# EAGLE schematic miavita (EAGLE 6.5.0)
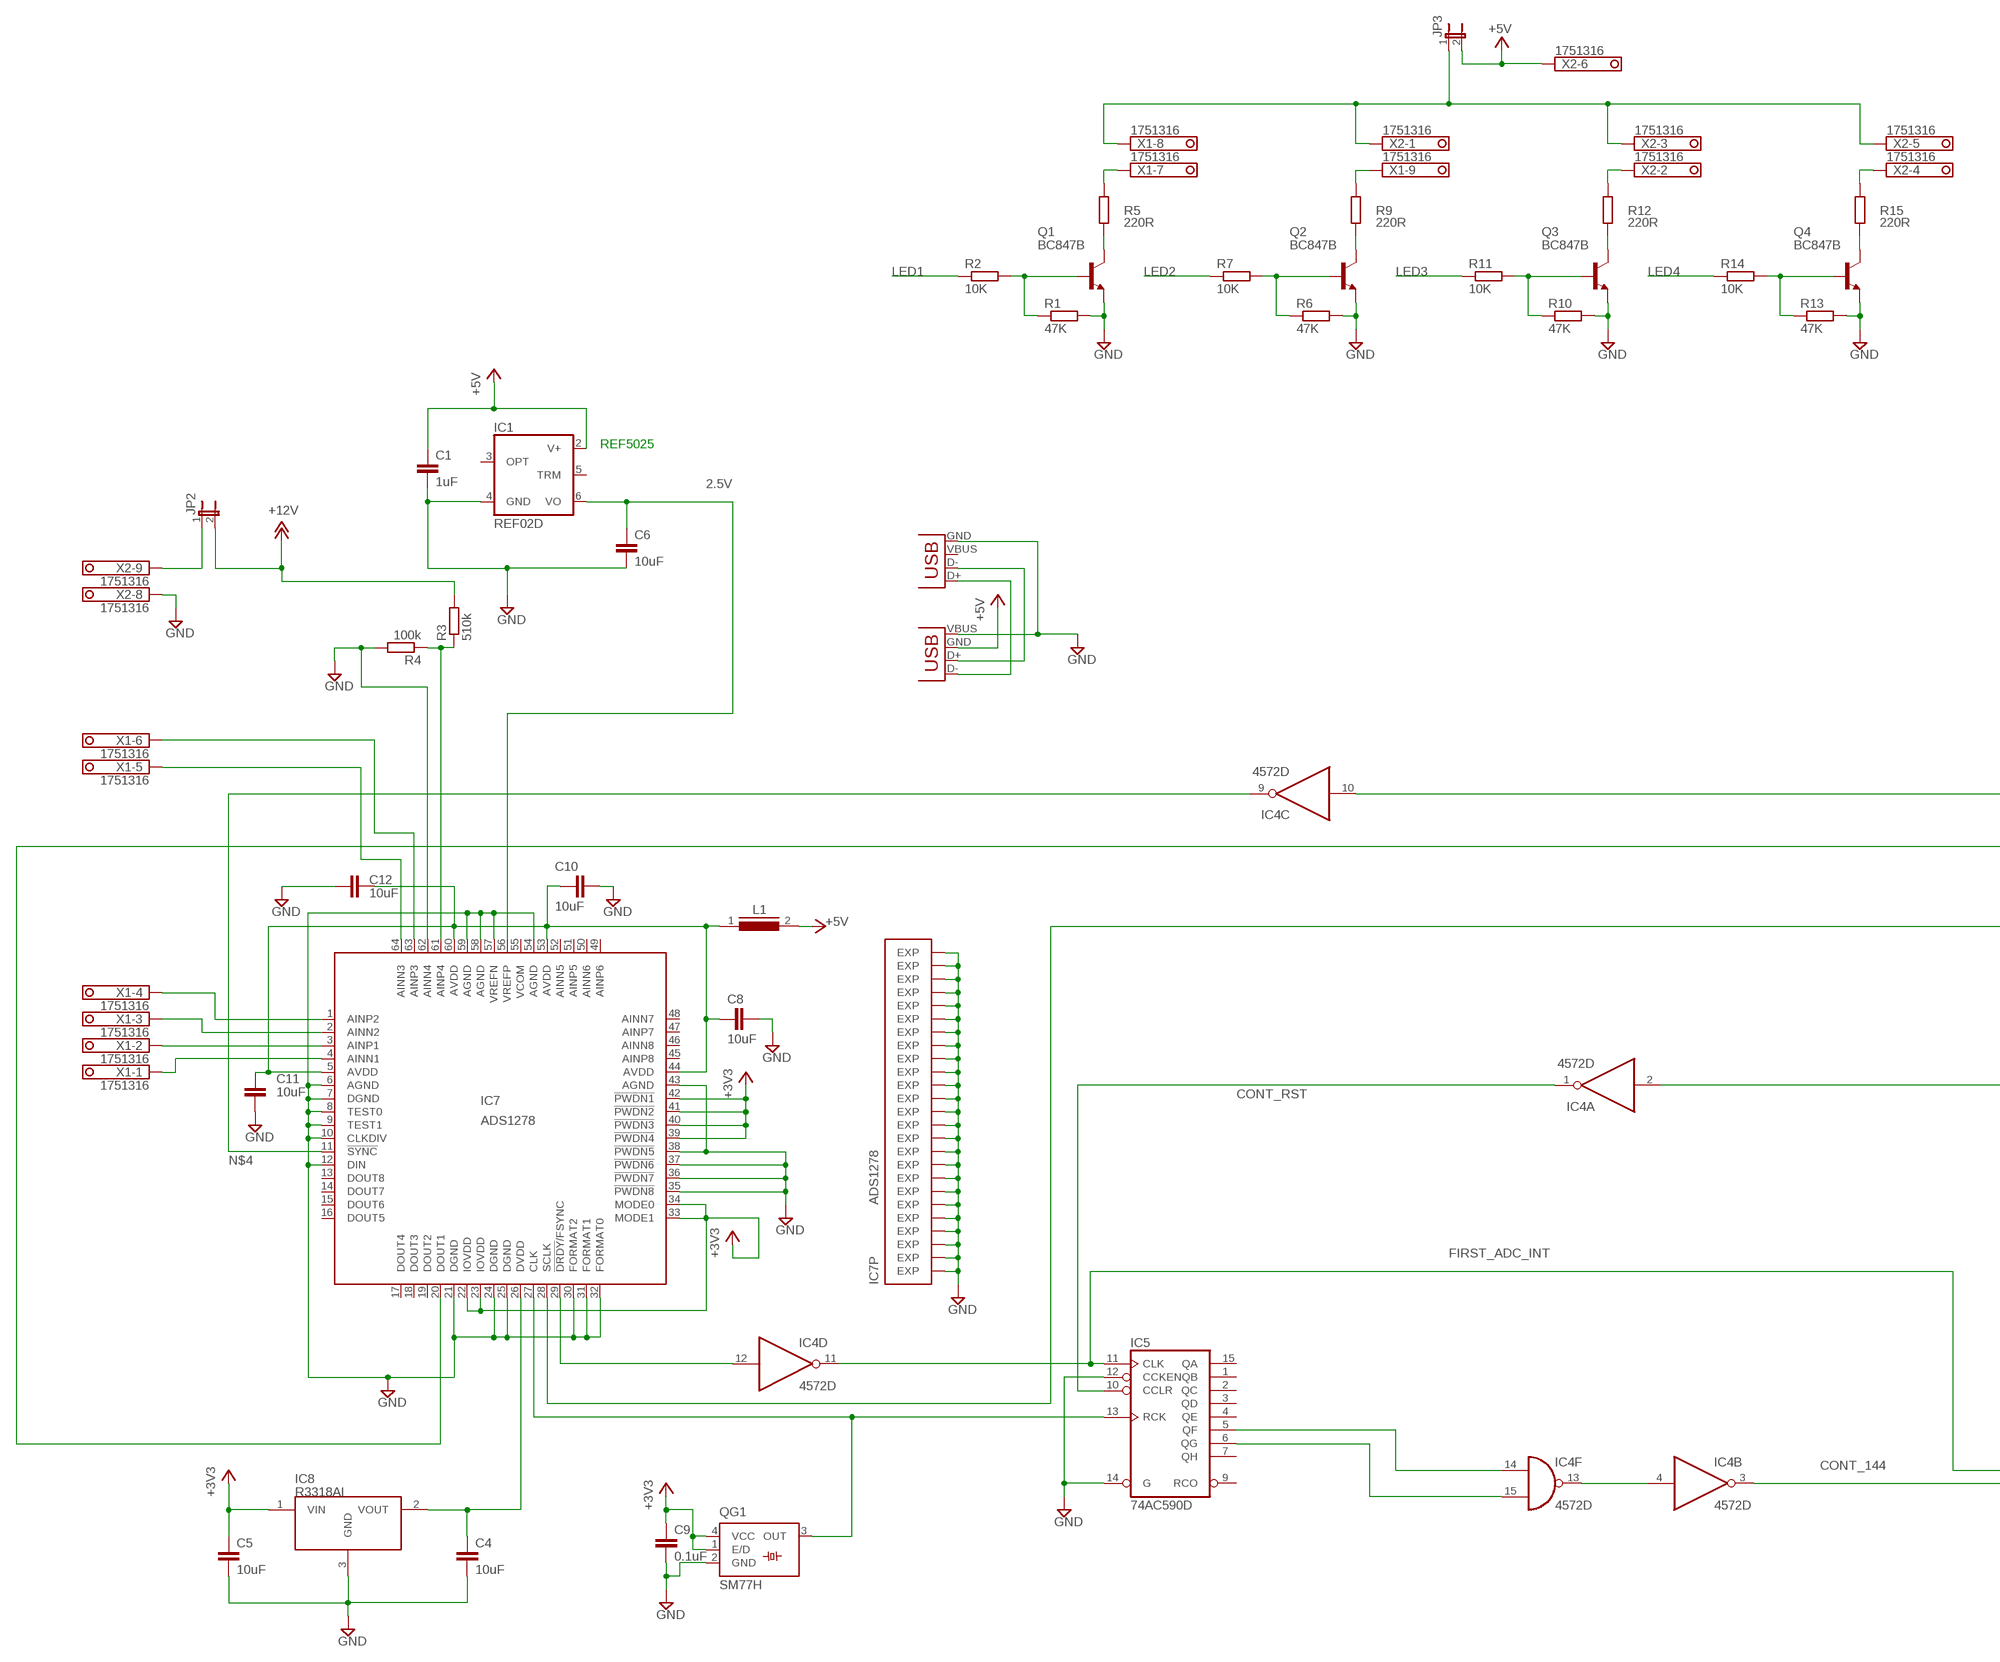
[diagram p0: schematic, sheet 1, part 1 of 2]
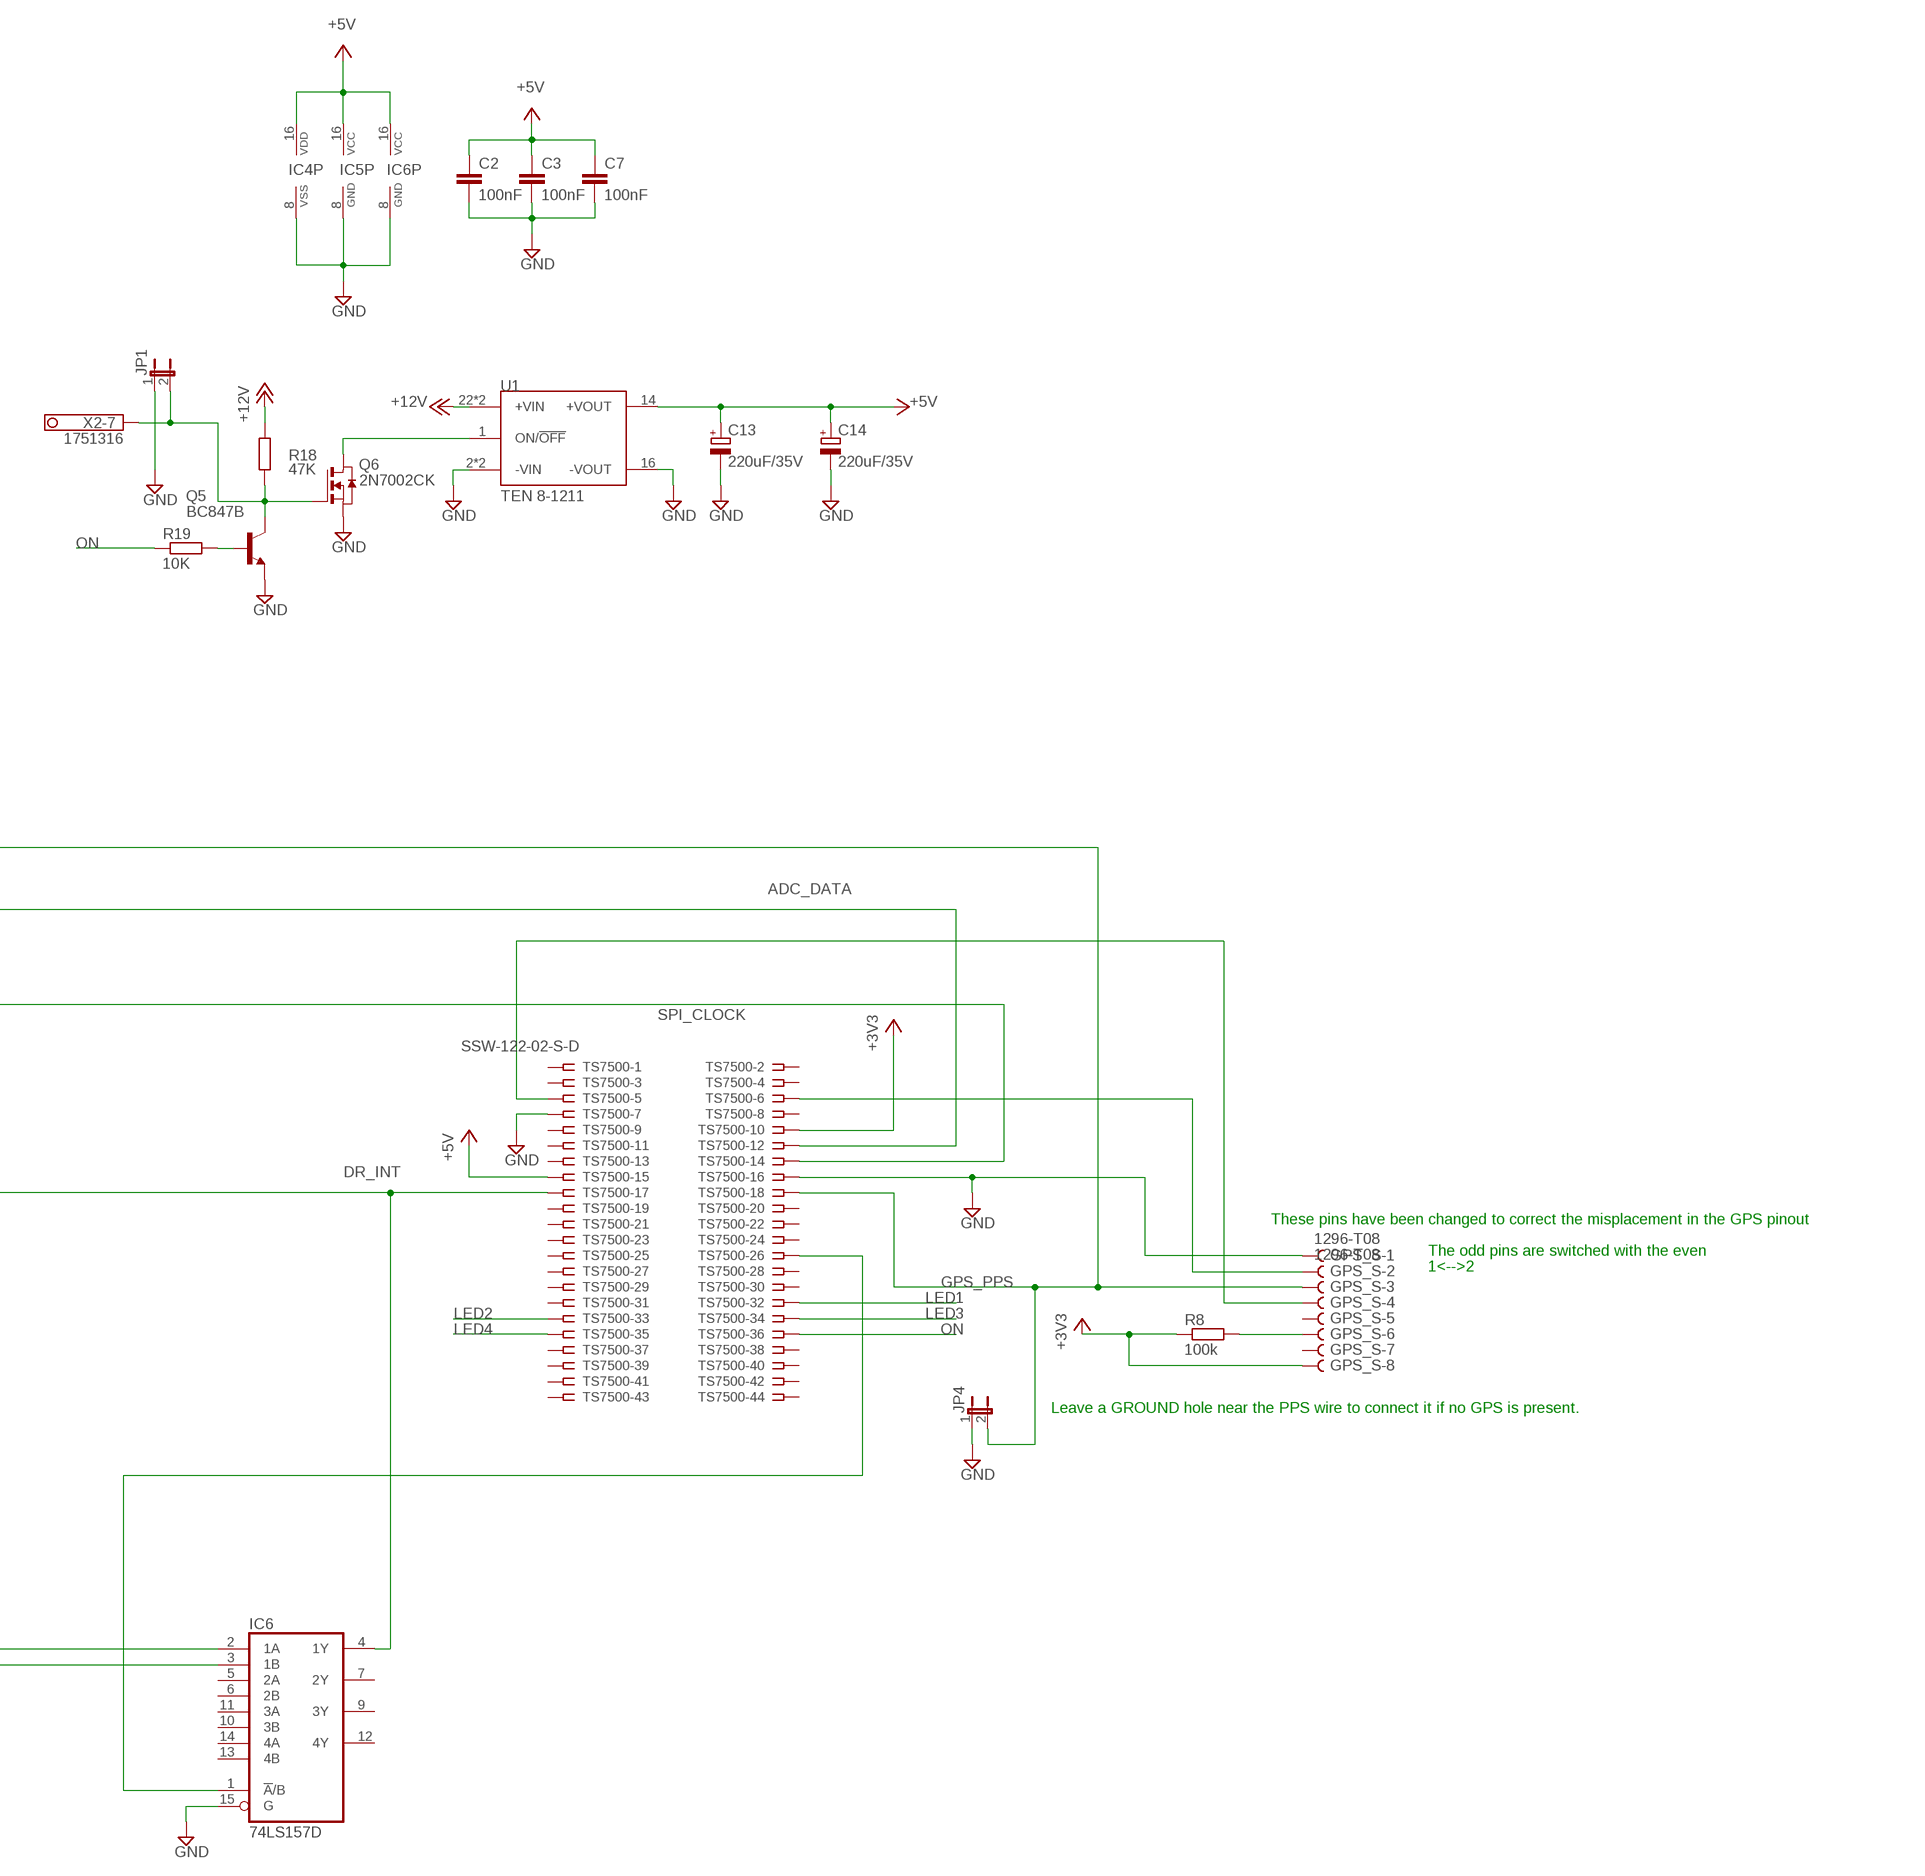
[diagram p1: schematic, sheet 1, part 2 of 2]

## Parts
C1  1uF  C-EUC0603  [C0603]
C2  100nF  C-EUC0603  [C0603]
C3  100nF  C-EUC0603  [C0603]
C4  10uF  C-EUC1210  [C1210]
C5  10uF  C-EUC1210  [C1210]
C6  10uF  C-EUC1210  [C1210]
C7  100nF  C-EUC0603  [C0603]
C8  10uF  C-EUC0805  [C0805]
C9  0.1uF  C-EUC0603  [C0603]
C10  10uF  C-EUC0805  [C0805]
C11  10uF  C-EUC0805  [C0805]
C12  10uF  C-EUC0805  [C0805]
C13  220uF/35V  CPOL-EUUD-10X10  [UD-10X10_NICHICON]
C14  220uF/35V  CPOL-EUUD-10X10  [UD-10X10_NICHICON]
GPS_S  1296-T08  [1296-08]
IC1  REF02D  [SO08]
IC4  4572D  [SO16]
IC5  74AC590D  [SO16]
IC6  74LS157D  [SO16]
IC7  ADS1278  [HTQFP-64-PAP]
IC8  R3318AI  MCP1525T-I/TT  [SOT23]
JP1  JP1E  [JP1]
JP2  JP1E  [JP1]
JP3  JP1E  [JP1]
JP4  JP1E  [JP1]
L1  FAIR-RITE_2506031027Y0  [L0603]
Q1  BC847B  BC847BLT1SMD  [SOT23]
Q2  BC847B  BC847BLT1SMD  [SOT23]
Q3  BC847B  BC847BLT1SMD  [SOT23]
Q4  BC847B  BC847BLT1SMD  [SOT23]
Q5  BC847B  BC847BLT1SMD  [SOT23]
Q6  2N7002CK  [SOT23]
QG1  SM77H  [SM77H]
R1  47K  R-EU_R0603  [R0603]
R2  10K  R-EU_R0603  [R0603]
R3  510k  R-EU_R0603  [R0603]
R4  100k  R-EU_R0603  [R0603]
R5  220R  R-EU_R0603  [R0603]
R6  47K  R-EU_R0603  [R0603]
R7  10K  R-EU_R0603  [R0603]
R8  100k  R-EU_R0603  [R0603]
R9  220R  R-EU_R0603  [R0603]
R10  47K  R-EU_R0603  [R0603]
R11  10K  R-EU_R0603  [R0603]
R12  220R  R-EU_R0603  [R0603]
R13  47K  R-EU_R0603  [R0603]
R14  10K  R-EU_R0603  [R0603]
R15  220R  R-EU_R0603  [R0603]
R18  47K  R-EU_R0603  [R0603]
R19  10K  R-EU_R0603  [R0603]
TS7500  SSW-122-02-S-D  [SSW-122-02-S-D]
U1  TEN 8-1211  TRACOPOWER_TEN-8-1211  [TRACOPOWER_TEN-8-SERIES]
USBA  USB-A-H  [USB-A-H]
USBB  USBPTH  [USB-B-PTH]
X1  1751316  [1751316]
X2  1751316  [1751316]

## Nets
2.5V: C6.1 IC1.6(VO) IC7.56(VREFP)
+1V8: C4.1 IC7.26(DVDD) IC8.2(VOUT)
+3V3: C5.1 C9.1 GPS_S.8 IC7.22(IOVDD) IC7.23(IOVDD) IC7.33(MODE1) IC7.34(MODE0) IC7.39(!PWDN4) IC7.40(!PWDN3) IC7.41(!PWDN2) IC7.42(!PWDN1) IC8.1(VIN) QG1.1(E/D) QG1.4(VCC) R8.1 TS7500.10
+5V: C1.1 C2.1 C3.1 C7.1 C13.+ C14.+ IC1.2(V+) IC4.16(P:VDD) IC5.16(VCC) IC6.16(VCC) JP3.2 L1.2 TS7500.15 U1.14(+VOUT) USBA.GND(VBUS) X2.6
+12V: JP2.2 R3.2 R18.1 U1.22(+VIN) U1.23(+VIN)
ADC_DATA: IC7.20(DOUT1) TS7500.12
CONT_144: IC4.3(B:O) IC6.3(1B)
CONT_RST: IC4.1(A:O) IC5.10(CCLR)
DR_INT: IC4.2(A:I) IC6.4(1Y) TS7500.17
FIRST_ADC_INT: IC4.11(D:O) IC5.11(CLK) IC6.2(1A)
GND: C1.2 C2.2 C3.2 C4.2 C5.2 C6.2 C7.2 C8.2 C9.2 C10.2 C11.2 C12.2 C13.- C14.- GPS_S.1 IC1.4(GND) IC4.8(P:VSS) IC5.8(GND) IC5.12(CCKEN) IC5.14(G) IC6.8(GND) IC6.15(G) IC7.6(AGND) IC7.7(DGND) IC7.8(TEST0) IC7.9(TEST1) IC7.10(CLKDIV) IC7.12(DIN) IC7.21(DGND) IC7.24(DGND) IC7.25(DGND) IC7.30(FORMAT2) IC7.31(FORMAT1) IC7.32(FORMAT0) IC7.35(!PWDN8) IC7.36(!PWDN7) IC7.37(!PWDN6) IC7.38(!PWDN5) IC7.43(AGND) IC7.54(AGND) IC7.57(VREFN) IC7.58(AGND) IC7.59(AGND) IC7.62(AINN4) IC7.EXP1(EXP) IC7.EXP2(EXP) IC7.EXP3(EXP) IC7.EXP4(EXP) IC7.EXP5(EXP) IC7.EXP6(EXP) IC7.EXP7(EXP) IC7.EXP8(EXP) IC7.EXP9(EXP) IC7.EXP10(EXP) IC7.EXP11(EXP) IC7.EXP12(EXP) IC7.EXP13(EXP) IC7.EXP14(EXP) IC7.EXP15(EXP) IC7.EXP16(EXP) IC7.EXP17(EXP) IC7.EXP18(EXP) IC7.EXP19(EXP) IC7.EXP20(EXP) IC7.EXP21(EXP) IC7.EXP22(EXP) IC7.EXP23(EXP) IC7.EXP24(EXP) IC7.EXP25(EXP) IC8.3(GND) JP1.1 JP4.1 Q1.2(E) Q2.2(E) Q3.2(E) Q4.2(E) Q5.2(E) Q6.2(S) QG1.2(GND) R1.2 R4.2 R6.2 R10.2 R13.2 TS7500.7 TS7500.16 U1.2(-VIN) U1.3(-VIN) U1.16(-VOUT) USBA.VBUS(GND) USBB.GND X2.8
GPS_PPS: GPS_S.3 IC4.10(C:I) JP4.2 TS7500.18
LED1: R2.1 TS7500.32
LED2: R7.1 TS7500.33
LED3: R11.1 TS7500.34
LED4: R14.1 TS7500.35
N$1: IC6.1(!A!/B) TS7500.26
N$2: IC4.15(F:I1) IC5.6(QG)
N$3: IC4.14(F:I0) IC5.5(QF)
N$4: IC4.9(C:O) IC7.11(!SYNC)
N$5: IC4.4(B:I) IC4.13(F:O)
N$7: IC4.12(D:I) IC7.29(!DRDY!/FSYNC)
N$8: IC7.3(AINP1) X1.2
N$9: Q5.1(B) R19.2
N$10: IC7.4(AINN1) X1.1
N$11: IC7.1(AINP2) X1.4
N$12: IC7.61(AINP4) R3.1 R4.1
N$13: USBA.D+(D-) USBB.D-
N$14: IC7.63(AINP3) X1.6
N$15: Q2.1(B) R6.1 R7.2
N$16: Q2.3(C) R9.1
N$17: IC5.13(RCK) IC7.27(CLK) QG1.3(OUT)
N$18: USBA.D-(D+) USBB.D+
N$19: C8.1 C10.1 C11.1 C12.1 IC7.5(AVDD) IC7.44(AVDD) IC7.53(AVDD) IC7.60(AVDD) L1.1
N$20: R9.2 X1.9
N$21: Q3.1(B) R10.1 R11.2
N$22: Q3.3(C) R12.1
N$23: R12.2 X2.2
N$24: Q4.1(B) R13.1 R14.2
N$25: Q4.3(C) R15.1
N$26: R15.2 X2.4
N$27: JP2.1 X2.9
N$28: JP3.1 X1.8 X2.1 X2.3 X2.5
N$29: IC7.2(AINN2) X1.3
N$31: JP1.2 Q5.3(C) Q6.1(G) R18.2 X2.7
N$32: Q6.3(D) U1.1(ON/!OFF)
N$34: IC7.64(AINN3) X1.5
N$37: Q1.3(C) R5.1
N$39: Q1.1(B) R1.1 R2.2
N$40: R5.2 X1.7
N$42: GPS_S.2 TS7500.6
N$43: GPS_S.4 TS7500.5
N$44: GPS_S.6 R8.2
ON: R19.1 TS7500.36
SPI_CLOCK: IC7.28(SCLK) TS7500.14
Unconnected: GPS_S.5 GPS_S.7 IC1.3(OPT) IC1.5(TRM) IC4.5(E:O) IC4.6(E:I0) IC4.7(E:I1) IC5.1(QB) IC5.2(QC) IC5.3(QD) IC5.4(QE) IC5.7(QH) IC5.9(RCO) IC5.15(QA) IC6.5(2A) IC6.6(2B) IC6.7(2Y) IC6.9(3Y) IC6.10(3B) IC6.11(3A) IC6.12(4Y) IC6.13(4B) IC6.14(4A) IC7.13(DOUT8) IC7.14(DOUT7) IC7.15(DOUT6) IC7.16(DOUT5) IC7.17(DOUT4) IC7.18(DOUT3) IC7.19(DOUT2) IC7.45(AINP8) IC7.46(AINN8) IC7.47(AINP7) IC7.48(AINN7) IC7.49(AINP6) IC7.50(AINN6) IC7.51(AINP5) IC7.52(AINN5) IC7.55(VCOM) TS7500.1 TS7500.2 TS7500.3 TS7500.4 TS7500.8 TS7500.9 TS7500.11 TS7500.13 TS7500.19 TS7500.20 TS7500.21 TS7500.22 TS7500.23 TS7500.24 TS7500.25 TS7500.27 TS7500.28 TS7500.29 TS7500.30 TS7500.31 TS7500.37 TS7500.38 TS7500.39 TS7500.40 TS7500.41 TS7500.42 TS7500.43 TS7500.44 USBB.VBUS

## Notes on the sheet
- REF5025
- These pins have been changed to correct the misplacement in the GPS pinout
- The odd pins are switched with the even
- 1<-->2
- Leave a GROUND hole near the PPS wire to connect it if no GPS is present.

## Library data of the parts
C1-C12 = resistor:C-EU: CAPACITOR, European symbol
C13 C14 = rcl:CPOL-EU: POLARIZED CAPACITOR, European symbol
GPS_S = con-leotronics:1296-T08: 1.27mm SINGLE ROW FEMALE SOCKET Source: http://www.leotronics.co.uk/Conexcon/Data%20Sheets/sec.%20A/1296ing.pdf; OC_FARNELL: unknown; OC_NEWARK: unknown
IC1 = linear:REF02: VOLTAGE REFERENCE
IC4 = 45xx:4572: INVERTER/OR/NOR (MC14572BCP)
IC5 = 74xx-eu:74*590: 8-bit binary COUNTER, output register
IC6 = 74xx-eu:74*157: Quadruple 2-line to 1-line data SELECTOR/MULTIPLEXER
IC7 = texas:ADS1278: Quad/Octal, Simultaneous Sampling, 24-Bit Analog-to-Digital Converters ADS1274 / ADS1278 Auto generated by make-symbol-device-package-bsdl.ulp Rev. 29 Source: http://focus.ti.com/lit/ds/symlink/ads1274.pdf; MPN: ADS1278IPAPT; OC_FARNELL: 1603419; OC_NEWARK: 50M8811
IC8 = referencias:MCP1525: 2.5V Voltage Reference; OC_FARNELL: 9758500
JP1-JP4 = jumper:JP1E: JUMPER
L1 = bobinas:FAIR-RITE_25*1027Y0: SMD EMI Suppression Ferrite Beads; OC_FARNELL: 1463451
Q1-Q5 = transistor-npn:BC847*: NPN Transistor
Q6 = mosfet:2N7002: N-channel TrenchMOS FET; OC_FARNELL: 1829183
QG1 = crystal:SM77H: 3.3V CMOS Clock Oscillator Source: www.pletronics.com .. sm77h%203.3v.pdf; OC_FARNELL: unknown; OC_NEWARK: unknown
R1-R15 R18 R19 = resistor:R-EU_: RESISTOR, European symbol
TS7500 = con-samtec:SSW-122-02-S-D: THROUGH-HOLE .025" SQ POST SOCKET Source: Samtec SSW.pdf; MPN: SSW-122-02-S-D; OC_FARNELL: unknown; OC_NEWARK: 11P9673
U1 = alimentacoes:TRACOPOWER_TEN-8-*: Traco Power TEN 8 series single output isolated voltage regulator
USBA USBB = SparkFun:USB: USB Connectors USB-B-PTH is fully proven SKU : PRT-00139 USB-miniB is fully proven SKU : PRT-00587 USB-A-PCB is untested. USB-A-H is throughly reviewed, but untested. Spark Fun Electronics SKU : PRT-00437 USB-B-SMT is throughly reviewed, but untested. Needs silkscreen touching up. USB-A-S has not been used/tested USB-MB-H has not been used/tested
X1 X2 = con-phoenix-350:1751316: MKDS 1/ 9-3,5 Printklemme Nennstrom: 10 A Bemessungsspannung: 160 V Raster: 3,5 mm Polzahl: 9 Montageart: Löten Anschlussart: Schraubanschluss Anschlussrichtung vom Leiter zur Platine: 0° Source: http://eshop.phoenixcontact.com .. 1751316.pdf; OC_FARNELL: unknown; OC_NEWARK: unknown